# EAGLE design keyboardController (EAGLE 7.6.0)
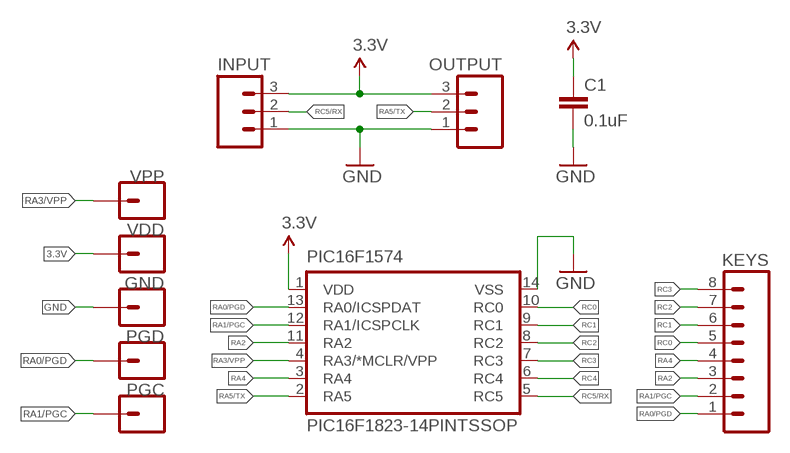
[diagram p0: schematic, sheet 1]

## Parts
C1  0.1uF  CAP0805  [0805]
GND  M01PTH  [1X01]
INPUT  M03LONGPADS  [1X03_LONGPADS]
KEYS  M08LONGPADS  [1X08_LONGPADS]
OUTPUT  M03LONGPADS  [1X03_LONGPADS]
PGC  M01PTH  [1X01]
PGD  M01PTH  [1X01]
PIC16F1574  PIC16F1823-14PINTSSOP  [TSSOP14]
VDD  M01PTH  [1X01]
VPP  M01PTH  [1X01]

## Nets
3.3V: C1.1 INPUT.3 OUTPUT.3 PIC16F1574.1(VDD) VDD.1
GND: C1.2 GND.1 INPUT.1 OUTPUT.1 PIC16F1574.14(VSS)
RA0/PGD: KEYS.1 PGD.1 PIC16F1574.13(RA0/ICSPDAT)
RA1/PGC: KEYS.2 PGC.1 PIC16F1574.12(RA1/ICSPCLK)
RA2: KEYS.3 PIC16F1574.11(RA2)
RA3/VPP: PIC16F1574.4(RA3/*MCLR/VPP) VPP.1
RA4: KEYS.4 PIC16F1574.3(RA4)
RA5/TX: OUTPUT.2 PIC16F1574.2(RA5)
RC0: KEYS.5 PIC16F1574.10(RC0)
RC1: KEYS.6 PIC16F1574.9(RC1)
RC2: KEYS.7 PIC16F1574.8(RC2)
RC3: KEYS.8 PIC16F1574.7(RC3)
RC4: PIC16F1574.6(RC4)
RC5/RX: INPUT.2 PIC16F1574.5(RC5)

## Library data of the parts
C1 = SparkFun-Passives:CAP: Capacitor Standard 0603 ceramic capacitor, and 0.1" leaded capacitor.
GND PGC PGD VDD VPP = SparkFun-Connectors:M01: Header 1 Standard 1-pin 0.1" header. Use with straight break away headers (SKU : PRT-00116), right angle break away headers (PRT-00553), swiss pins (PRT-00743), machine pins (PRT-00117), and female headers (PRT-00115). SMTSO-256-ET is a "flush mount" nut for a 4-40 screw. The older package used to be too tight, and did not allow it to sit properly thru the drill hit. The latest (0.165DIA) fits nice and snug.
INPUT OUTPUT = SparkFun-Connectors:M03: Header 3 Standard 3-pin 0.1" header. Use with straight break away headers (SKU : PRT-00116), right angle break away headers (PRT-00553), swiss pins (PRT-00743), machine pins (PRT-00117), and female headers (PRT-00115). Molex polarized connector foot print use with SKU : PRT-08232 with associated crimp pins and housings.
KEYS = SparkFun-Connectors:M08: Header 8 Standard 8-pin 0.1" header. Use with straight break away headers (SKU : PRT-00116), right angle break away headers (PRT-00553), swiss pins (PRT-00743), machine pins (PRT-00117), and female headers (PRT-00115).
PIC16F1574 = SparkFun-DigitalIC:PIC16F1823-14PIN; PROD_ID: IC-11992

## Net classes
1 power: width 0.61 mm

## Board
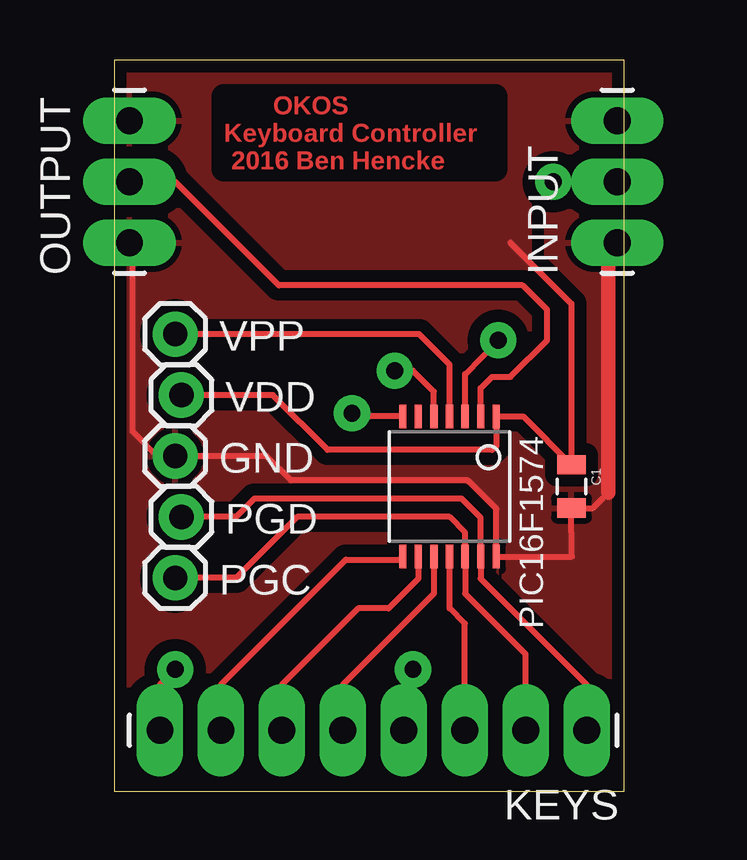
[diagram p1: board, top side]
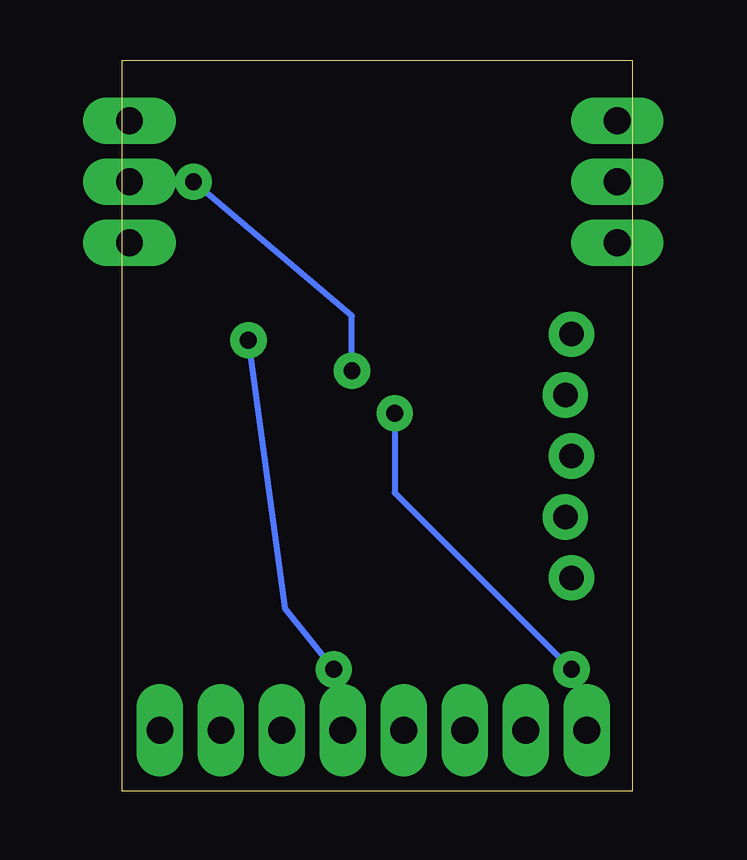
[diagram p2: board, bottom side, seen from below]

Size 21.26 x 30.47 mm. Coordinates in mm from the lower left corner, seen from the top.
Outline: 0,0 21.26,0 21.26,30.47 0,30.47 0,0
Copper layers (1*16): Top 0.035mm / dielectric 1.5mm / Bottom 0.035mm
Design rules "bens homebrew *": minimum track width 10mil, minimum drill 0.7mm, track to track 12mil, track to pad 12mil, pad to pad 12mil, via to via 12mil, smd to smd 8mil, copper to edge 5mil, drill to drill 8mil, minimum pad ring 16mil, minimum via ring 16mil, stop-mask expansion 4mil, vias tented up to drill 0mil, thermal gap 10mil

### Footprints (pad centres in the part's own frame; a part is rotated, then mirrored left to right if it is on the bottom)
0805 = smd 0.8 x 1.2: 1 -0.9,0; 2 0.9,0
1X01 = drill 1.016 pad 1.88: 1 0,0
1X03_LONGPADS = drill 1.118 pad 1.88 long: 1 0,0; 2 2.54,0; 3 5.08,0
1X08_LONGPADS = drill 1.118 pad 1.88 long: 1 0,0; 2 2.54,0; 3 5.08,0; 4 7.62,0; 5 10.16,0; 6 12.7,0; 7 15.24,0; 8 17.78,0
TSSOP14 = smd 0.305 x 0.991: 1 -1.95,-2.918; 2 -1.3,-2.918; 3 -0.65,-2.918; 4 0,-2.918; 5 0.65,-2.918; 6 1.3,-2.918; 7 1.95,-2.918; 8 1.95,2.918; 9 1.3,2.918; 10 0.65,2.918; 11 0,2.918; 12 -0.65,2.918; 13 -1.3,2.918; 14 -1.95,2.918

### Placement (x,y rotation side)
C1  19.05,12.7 270 top
GND  2.54,13.97 0 top
INPUT  20.95,22.86 90 top
KEYS  19.68,2.54 180 top
OUTPUT  0.64,22.86 90 top
PGC  2.54,8.89 0 top
PGD  2.79,11.43 0 top
PIC16F1574  13.97,12.7 180 top
VDD  2.79,16.51 0 top
VPP  2.54,19.05 0 top

### Tracks (layer width: path | path; a pad name or v marks a point on that pad's centre or on a via)
3.3V
  Top 0.254: 16.51,22.86 19.05,20.32 C1.1 17.03,15.62 PIC16F1574.1 15.92,14.4 15.75,14.22 8.89,14.22 6.6,16.51 VDD.1
  pour Top (isolate 0.508, rank 3): 21.59,30.48 21.59,24.89 17.27,24.89 17.27,21.08 6.86,21.08 2.54,25.4 0,25.4 0,30.48
GND
  Top 0.254: OUTPUT.1 0.76,22.73 0.76,14.99 1.78,13.97 GND.1 6.35,13.97 7.37,12.95 14.73,12.95 15.92,11.77 PIC16F1574.14 19.06,9.78 C1.2 19.93,11.8 20.57,12.45 | 20.57,22.73 21.08,22.73 INPUT.1
  Top 0.61: 20.57,12.45 20.57,21.08 20.57,22.73
  pour Top (isolate 0.508, rank 6): 21.59,25.4 0,25.4 0,0 21.59,0
RA0/PGD
  Top 0.254: KEYS.1 19.68,4.45 19.05,5.08 15.27,8.86 PIC16F1574.13 15.27,11.4 14.48,12.19 5.84,12.19 5.08,11.43 PGD.1
RA1/PGC
  Top 0.254: KEYS.2 17.14,5.71 16.51,6.35 14.62,8.24 PIC16F1574.12 14.62,10.78 13.97,11.43 7.62,11.43 5.08,8.89 PGC.1
RA2
  Top 0.254: KEYS.3 14.61,6.99 13.97,7.62 PIC16F1574.11
RA3/VPP
  Top 0.254: PIC16F1574.4 13.97,17.78 12.7,19.05 7.62,19.05 6.35,19.05 VPP.1
RA4  (via drill 0.7)
  Top 0.254: PIC16F1574.3 14.62,17.38 v16,18.8 | v12.45,5.08 12.19,2.67 KEYS.4
  Bottom 0.254: v16,18.8 14.48,7.62 v12.45,5.08
RA5/TX
  Top 0.254: PIC16F1574.2 15.27,16.79 15.75,17.27 16.51,17.27 18.03,18.8 18.03,20.07 17.02,21.08 6.86,21.08 2.54,25.4 OUTPUT.2
RC0
  Top 0.254: KEYS.5 9.53,4.45 12.7,7.62 13.32,8.24 PIC16F1574.10
RC1
  Top 0.254: KEYS.6 6.99,4.45 10.16,7.62 11.43,7.62 12.67,8.86 PIC16F1574.9
RC2
  Top 0.254: KEYS.7 4.45,4.45 9.65,9.65 11.89,9.65 PIC16F1574.8
RC3  (via drill 0.7)
  Top 0.254: PIC16F1574.7 10.04,15.62 v9.91,15.75 | KEYS.8 1.91,4.45 v2.54,5.08
  Bottom 0.254: v9.91,15.75 9.91,12.45 v2.54,5.08
RC5/RX  (via drill 0.7)
  Top 0.254: PIC16F1574.5 13.32,16.65 12.45,17.53 v11.68,17.53 | v18.29,25.4 INPUT.2
  Bottom 0.254: v11.68,17.53 11.68,19.81 v18.29,25.4

### Text on the board
Top: OKOS / Keyboard Controller / 2016 Ben Hencke